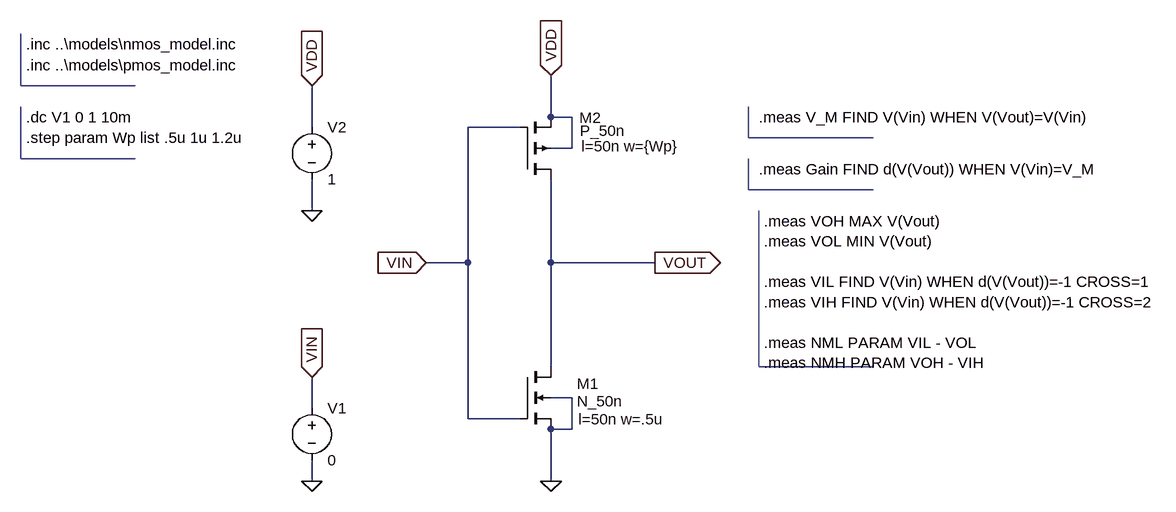
[diagram p0: schematic dc_analysis.asc]
dc_analysis.asc, the LTspice schematic file:
Version 4.1
SHEET 1 1256 680
WIRE 288 -32 288 -96
WIRE 320 -32 288 -32
WIRE -80 -16 -80 -80
WIRE 240 -16 160 -16
WIRE 320 16 320 -32
WIRE 320 16 288 16
WIRE -80 112 -80 64
WIRE 160 192 160 -16
WIRE 160 192 96 192
WIRE 288 192 288 64
WIRE 448 192 288 192
WIRE 288 352 288 192
WIRE 320 400 288 400
WIRE -80 416 -80 368
WIRE 160 432 160 192
WIRE 240 432 160 432
WIRE 320 448 320 400
WIRE 320 448 288 448
WIRE -80 528 -80 496
WIRE 288 528 288 448
FLAG -80 112 0
FLAG -80 528 0
FLAG 288 528 0
FLAG 288 -96 VDD
IOPIN 288 -96 In
FLAG -80 -80 VDD
IOPIN -80 -80 In
FLAG -80 368 VIN
IOPIN -80 368 In
FLAG 96 192 VIN
IOPIN 96 192 In
FLAG 448 192 VOUT
IOPIN 448 192 Out
SYMBOL nmos4 240 352 R0
WINDOW 0 88 26 Left 2
WINDOW 3 88 53 Left 2
WINDOW 123 90 81 Left 2
SYMATTR InstName M1
SYMATTR Value N_50n
SYMATTR Value2 l=50n w=.5u
SYMBOL pmos4 240 64 M180
WINDOW 0 92 95 Left 2
WINDOW 3 93 75 Left 2
WINDOW 123 95 51 Left 2
SYMATTR InstName M2
SYMATTR Value P_50n
SYMATTR Value2 l=50n w={Wp}
SYMBOL voltage -80 400 R0
SYMATTR InstName V1
SYMATTR Value 0
SYMBOL voltage -80 -32 R0
SYMATTR InstName V2
SYMATTR Value 1
TEXT -520 -144 Left 2 !.inc ..\\models\\nmos_model.inc
TEXT -520 -112 Left 2 !.inc ..\\models\\pmos_model.inc
TEXT -520 -32 Left 2 !.dc V1 0 1 10m
TEXT -520 0 Left 2 !.step param Wp list .5u 1u 1.2u
TEXT 608 -32 Left 2 !.meas V_M FIND V(Vin) WHEN V(Vout)=V(Vin)
TEXT 608 48 Left 2 !.meas Gain FIND d(V(Vout)) WHEN V(Vin)=V_M
TEXT 616 128 Left 2 !.meas VOH MAX V(Vout)\n.meas VOL MIN V(Vout)\n \n.meas VIL FIND V(Vin) WHEN d(V(Vout))=-1 CROSS=1\n.meas VIH FIND V(Vin) WHEN d(V(Vout))=-1 CROSS=2\n \n.meas NML PARAM VIL - VOL\n.meas NMH PARAM VOH - VIH
LINE Normal -528 -80 -528 -160
LINE Normal -352 -80 -528 -80
LINE Normal -528 32 -528 -48
LINE Normal -352 32 -528 32
LINE Normal 592 0 592 -48
LINE Normal 784 0 592 0
LINE Normal 592 80 592 32
LINE Normal 784 80 592 80
LINE Normal 608 352 608 112
LINE Normal 784 352 608 352

The netlist it stands for:
* dc_analysis.asc
M1 VOUT VIN 0 0 N_50n l=50n w=.5u
M2 VOUT VIN VDD VDD P_50n l=50n w={Wp}
V1 VIN 0 0
V2 VDD 0 1
.model NMOS NMOS
.model PMOS PMOS
.lib standard.mos
.inc ..\models\nmos_model.inc
.inc ..\models\pmos_model.inc
.dc V1 0 1 10m
.step param Wp list .5u 1u 1.2u
.meas V_M FIND V(Vin) WHEN V(Vout)=V(Vin)
.meas Gain FIND d(V(Vout)) WHEN V(Vin)=V_M
.meas VOH MAX V(Vout)
.meas VOL MIN V(Vout)
.meas VIL FIND V(Vin) WHEN d(V(Vout))=-1 CROSS=1
.meas VIH FIND V(Vin) WHEN d(V(Vout))=-1 CROSS=2
.meas NML PARAM VIL - VOL
.meas NMH PARAM VOH - VIH
.backanno
.end